# EAGLE schematic UV Lamp (EAGLE 8.0.0)
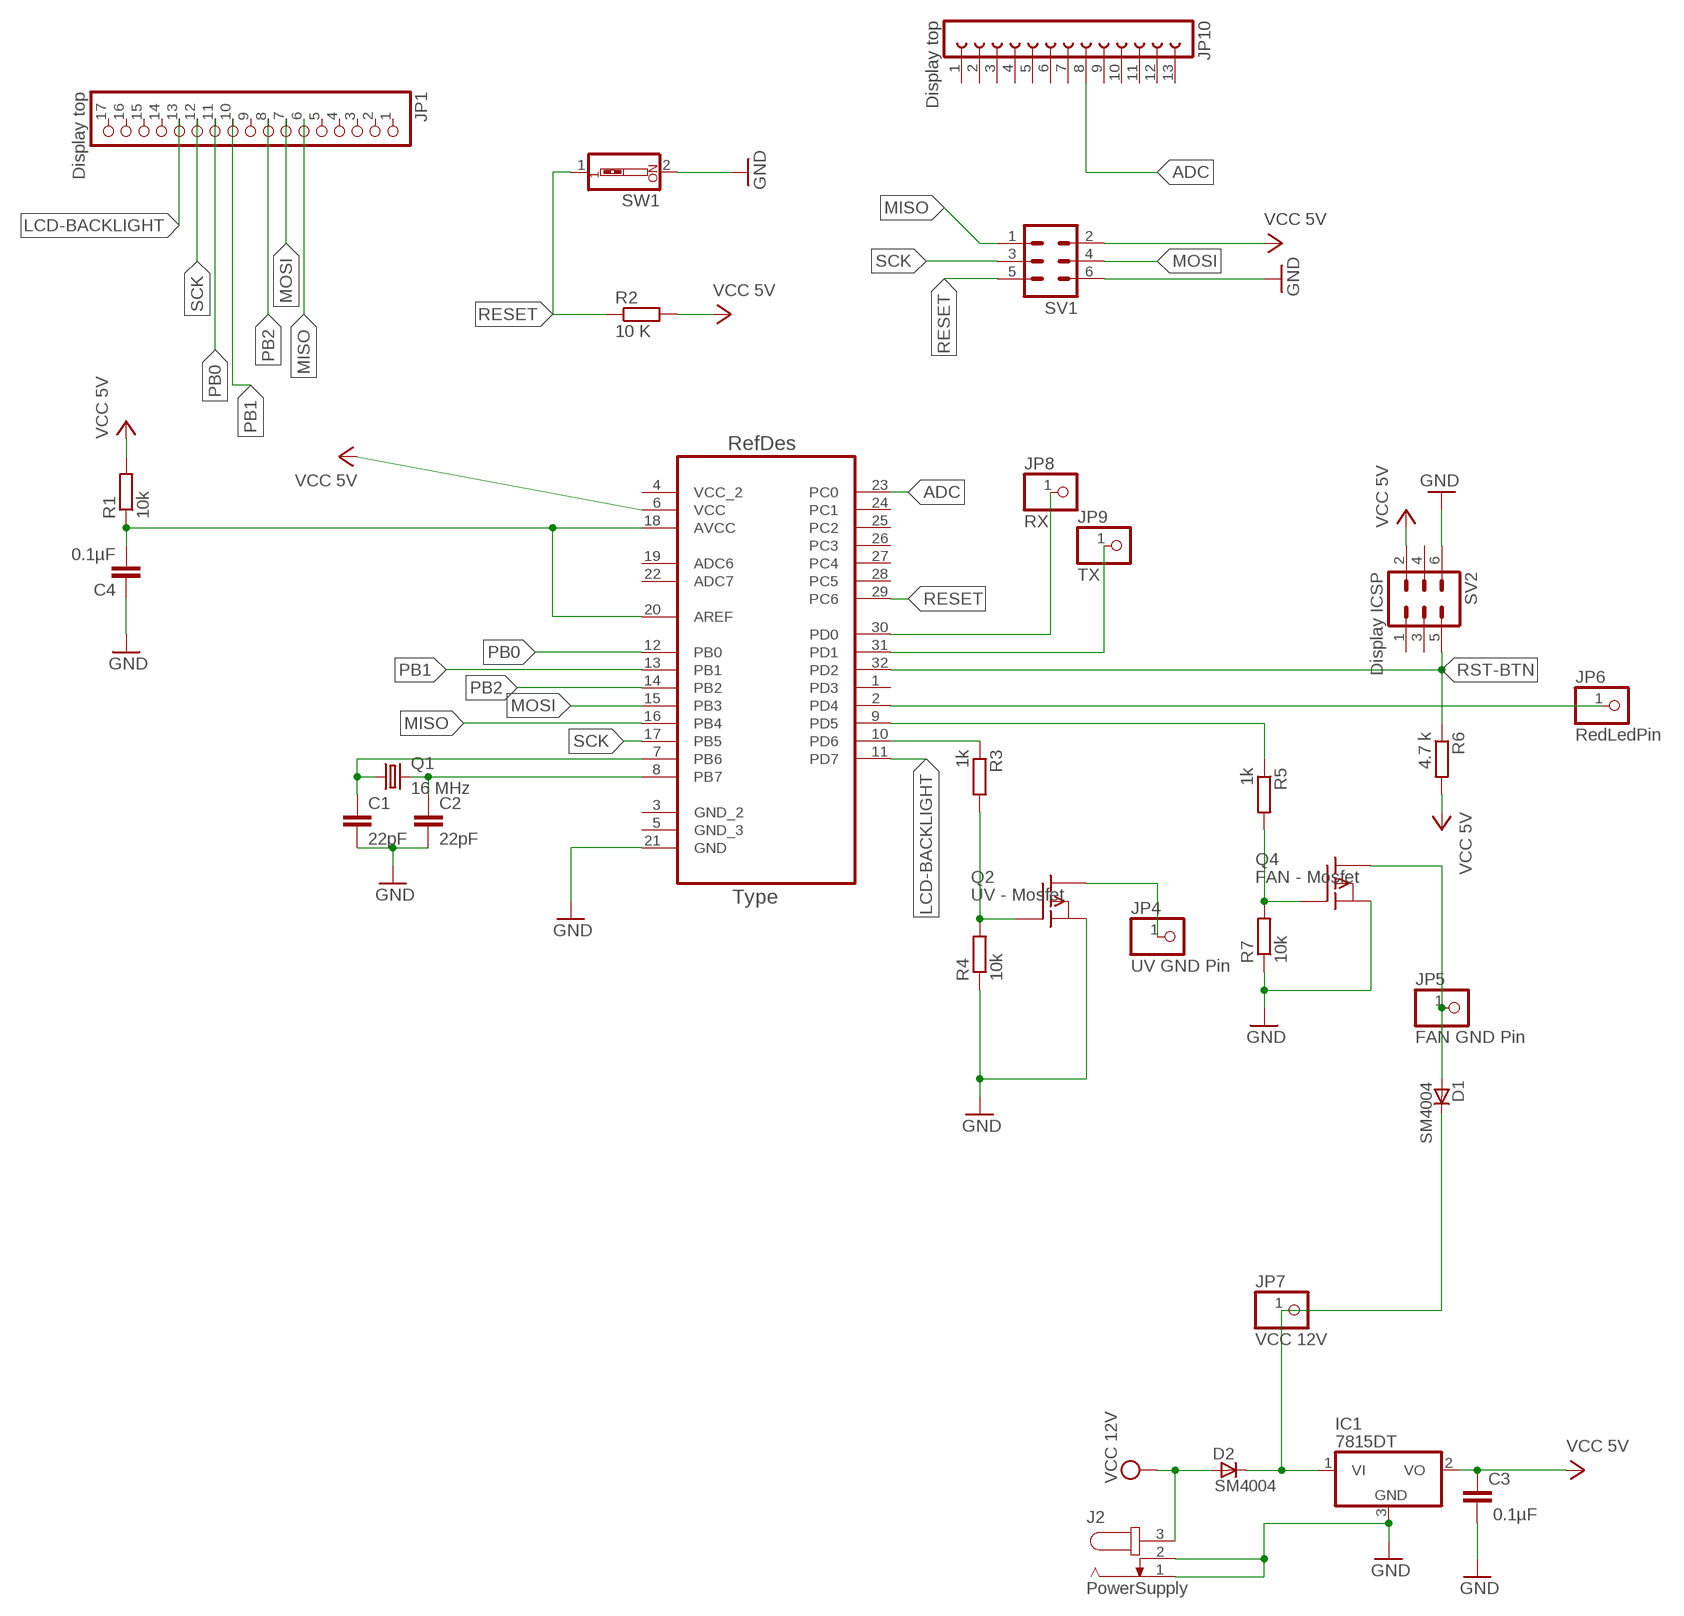
[diagram p0: schematic, sheet 1]

## Parts
C1  22pF  C-EUC1206  [C1206]
C2  22pF  C-EUC1206  [C1206]
C3  0.1µF  C-EUC1206  [C1206]
C4  0.1µF  C-EUC1206  [C1206]
D1  SM4004  [MELF-MLL41_DO213AB]
D2  SM4004  [MELF-MLL41_DO213AB]
IC1  7815DT  [TO252]
J2  PowerSupply  JACK-PLUG1  [SPC4078]
JP1  Display top  PINHD-1X17  [1X17]
JP4  UV GND Pin  PINHD-1X1  [1X01]
JP5  FAN GND Pin  PINHD-1X1  [1X01]
JP6  RedLedPin  PINHD-1X1  [1X01]
JP7  VCC 12V  PINHD-1X1  [1X01]
JP8  RX  PINHD-1X1  [1X01]
JP9  TX  PINHD-1X1  [1X01]
JP10  Display top  FE13-1  [FE13]
Q1  16 MHz  CRYSTALHC49UP  [HC49UP]
Q2  UV - Mosfet  SUP65P06-20  [TO220]
Q4  FAN - Mosfet  SUP65P06-20  [TO220]
R1  10k  R-EU_R1206  [R1206]
R2  10 K  R-EU_R1206  [R1206]
R3  1k  R-EU_R1206  [R1206]
R4  10k  R-EU_R1206  [R1206]
R5  1k  R-EU_R1206  [R1206]
R6  4.7 k  R-EU_R1206  [R1206]
R7  10k  R-EU_R1206  [R1206]
SV1  MA03-2  [MA03-2]
SV2  Display ICSP  MA03-2  [MA03-2]
SW1  SW_DIP-1  [EDG-01]
U1  ATMEGA328P-AU  [QFP80P900X900X120-32N]

## Nets
ADC: JP10.8 U1.23(PC0)
CLK1: C2.1 Q1.2 U1.8(PB7)
CLK2: C1.1 Q1.1 U1.7(PB6)
FAN-GND: D1.A JP5.1 Q4.2(D)
FANPIN: R5.1 U1.9(PD5)
GND: C1.2 C2.2 C3.2 C4.1 IC1.3(GND) J2.1 J2.2 Q2.3(S) Q4.3(S) R4.1 R7.1 SV1.6(MISO) SV2.6(MISO) SW1.2 U1.21(GND)
LCD-BACKLIGHT: JP1.13 U1.11(PD7)
MISO: JP1.6 SV1.1 U1.16(PB4)
MOSI: JP1.7 SV1.4 U1.15(PB3)
N$1: C4.2 R1.1 U1.18(AVCC) U1.20(AREF)
N$4: Q2.1(G) R3.2 R4.2
N$12: Q4.1(G) R5.2 R7.2
N$17: D2.C IC1.1(VI) JP7.1
PB0: JP1.11 U1.12(PB0)
PB1: JP1.10 U1.13(PB1)
PB2: JP1.8 U1.14(PB2)
REDLED: JP6.1 U1.2(PD4)
RESET: R2.1 SV1.5 SW1.1 U1.29(PC6)
RST-BTN: R6.1 SV2.5 U1.32(PD2)
RX: JP8.1 U1.30(PD0)
SCK: JP1.12 SV1.3 U1.17(PB5)
TX: JP9.1 U1.31(PD1)
UV-GND [UV-GND]: JP4.1 Q2.2(D)
UVPIN: R3.1 U1.10(PD6)
VCC-5V: C3.1 D1.C IC1.2(VO) R1.2 R2.2 R6.2 SV1.2 SV2.2 U1.6(VCC) ; supply symbol labelled VCC 5V
VCC-12V: D2.A J2.3 ; supply symbol labelled VCC 12V
Unconnected: JP1.1 JP1.2 JP1.3 JP1.4 JP1.5 JP1.9 JP1.14 JP1.15 JP1.16 JP1.17 JP10.1 JP10.2 JP10.3 JP10.4 JP10.5 JP10.6 JP10.7 JP10.9 JP10.10 JP10.11 JP10.12 JP10.13 SV2.1 SV2.3 SV2.4 U1.1(PD3) U1.3(GND_2) U1.5(GND_3) U1.19(ADC6) U1.22(ADC7) U1.24(PC1) U1.25(PC2) U1.26(PC3) U1.27(PC4) U1.28(PC5)

## Power pins joined to a net without a drawn wire
VCC_2: U1.4(VCC_2)

## Library data of the parts
C1-C4 = rcl:C-EU: CAPACITOR, European symbol
D1 D2 = _hhn_diodes_smd:SM400*: SM4001 .. SM4007 General Purpose Rectifier, 1 A SMD-Version of 1N4001 .. 1N4007 Case: MELF-MLL41 = DO 213 AB Author: Dipl.-Ing. FH Rainer Bayer HHN Hochschule Heilbronn, rainer.bayer@hs-heilbronn.de Ingenieurbüro ing-rb, mail@ing-rb.de
IC1 = linear:78*: Positive VOLTAGE REGULATOR Source: http://cache.national.com/ds/LM/LM78L05.pdf http://www.fairchildsemi.com/ds/LM/LM7805.pdf
J2 = con-jack:JACK-PLUG: DC POWER JACK Power Jack, DC, Right Angle, Through Hole, Rated 5A at 16VDC, PC Terminals Distributor: Farnell (www.Farnell.de) Drawing: 84N1161.pdf / 84N1162.pdf Manufacturer: SPC Technology (www.spctechnology.com) Type: SPC4077 / SPC 4078; OC_FARNELL: unknown; OC_NEWARK: unknown
JP1 = pinhead:PINHD-1X17: PIN HEADER
JP4-JP9 = pinhead:PINHD-1X1: PIN HEADER
JP10 = con-lsta:FE13-1: FEMALE HEADER; OC_FARNELL: unknown; OC_NEWARK: unknown
Q1 = crystal:CRYSTAL: CRYSTAL; OC_FARNELL: unknown; OC_NEWARK: unknown
Q2 Q4 = transistor-fet:SUP65P06-20: P-Channel Enhancement MOSFET -60V; 60A; 0,020Ohm
R1-R7 = rcl:R-EU_: RESISTOR, European symbol
SV1 SV2 = con-lstb:MA03-2: PIN HEADER; OC_FARNELL: unknown; OC_NEWARK: unknown
SW1 = special:SW_DIP-1: DIP SWITCH
U1 = Atmel-ATMEGA328P-AU:ATMEGA328P-AU; DESCRIPTION: 8-bit Microcontroller with In-System Programmable Flash; MPN: ATMEGA328P-AU; OC_FARNELL: 1715486; OC_NEWARK: 14R4631; PACKAGE: TQFP-32; SUPPLIER: Atmel

## Net classes
1 UV-GND: clearance 0.025 mm
2 FAN-GND: clearance 0.025 mm